# Altium schematic sheet lixie_schematic.SchDoc
size A4; SheetNumber: 1; SheetTotal: 1
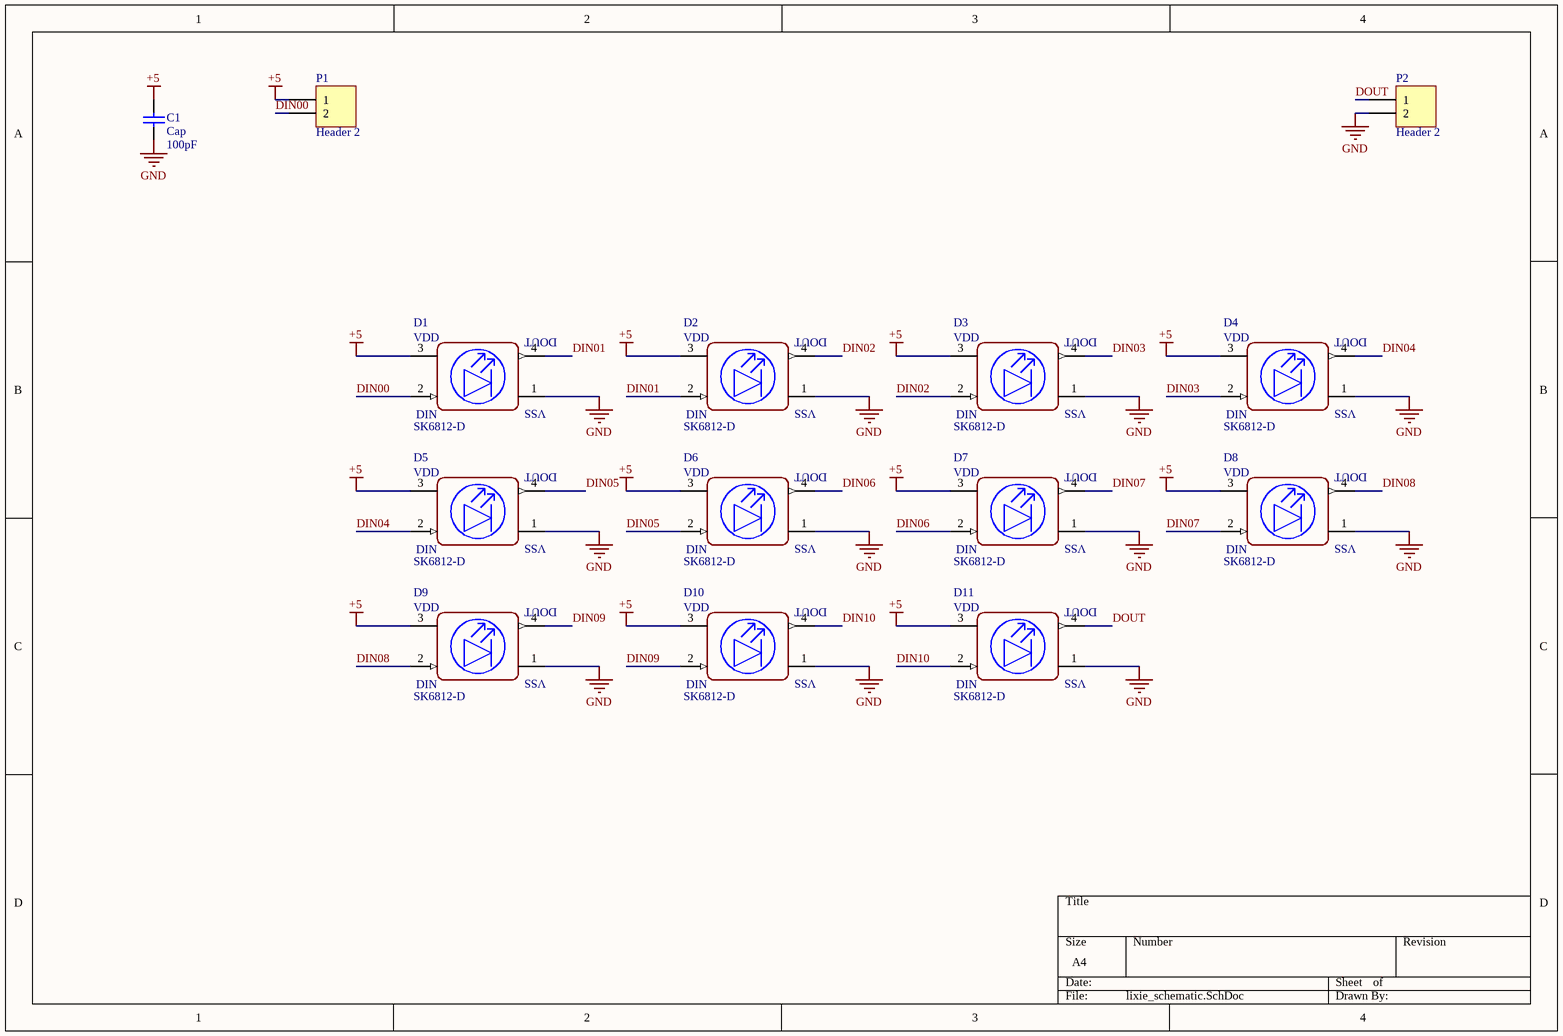
[diagram p0: lixie_schematic.SchDoc]

## Parts
C1  Cap  value 100pF  [RAD-0.3]
D1  Part Number: SK6812-D  [Adafruit_SK6812-D_0]  (hidden comment: Diode_Adafruit_SK6812-D_eec)
D2  Part Number: SK6812-D  [Adafruit_SK6812-D_0]  (hidden comment: Diode_Adafruit_SK6812-D_eec)
D3  Part Number: SK6812-D  [Adafruit_SK6812-D_0]
D4  Part Number: SK6812-D  [Adafruit_SK6812-D_0]  (hidden comment: Diode_Adafruit_SK6812-D_eec)
D5  Part Number: SK6812-D  [Adafruit_SK6812-D_0]  (hidden comment: Diode_Adafruit_SK6812-D_eec)
D6  Part Number: SK6812-D  [Adafruit_SK6812-D_0]  (hidden comment: Diode_Adafruit_SK6812-D_eec)
D7  Part Number: SK6812-D  [Adafruit_SK6812-D_0]  (hidden comment: Diode_Adafruit_SK6812-D_eec)
D8  Part Number: SK6812-D  [Adafruit_SK6812-D_0]  (hidden comment: Diode_Adafruit_SK6812-D_eec)
D9  Part Number: SK6812-D  [Adafruit_SK6812-D_0]  (hidden comment: Diode_Adafruit_SK6812-D_eec)
D10  Part Number: SK6812-D  [Adafruit_SK6812-D_0]  (hidden comment: Diode_Adafruit_SK6812-D_eec)
D11  Part Number: SK6812-D  [Adafruit_SK6812-D_0]  (hidden comment: Diode_Adafruit_SK6812-D_eec)
P1  Header 2  [HDR1X2]
P2  Header 2  [HDR1X2]

## Nets
+5: C1.2 D1.3(VDD) D2.3(VDD) D3.3(VDD) D4.3(VDD) D5.3(VDD) D6.3(VDD) D7.3(VDD) D8.3(VDD) D9.3(VDD) D10.3(VDD) D11.3(VDD) P1.1
GND: C1.1 D1.1(VSS) D2.1(VSS) D3.1(VSS) D4.1(VSS) D5.1(VSS) D6.1(VSS) D7.1(VSS) D8.1(VSS) D9.1(VSS) D10.1(VSS) D11.1(VSS) P2.2
DIN00: D1.2(DIN) P1.2
DIN01: D1.4(DOUT) D2.2(DIN)
DIN02: D2.4(DOUT) D3.2(DIN)
DIN03: D3.4(DOUT) D4.2(DIN)
DIN04: D4.4(DOUT) D5.2(DIN)
DIN05: D5.4(DOUT) D6.2(DIN)
DIN06: D6.4(DOUT) D7.2(DIN)
DIN07: D7.4(DOUT) D8.2(DIN)
DIN08: D8.4(DOUT) D9.2(DIN)
DIN09: D9.4(DOUT) D10.2(DIN)
DIN10: D10.4(DOUT) D11.2(DIN)
DOUT: D11.4(DOUT) P2.1

## Library data of the parts
C1 = Cap: Capacitor; Published: 8-Jun-2000; LatestRevisionDate: 17-Jul-2002; LatestRevisionNote: Re-released for DXP Platform.; PackageReference: RAD-0.3; Publisher: Altium Limited; PackageDescription: Radial Cap, Thru-Hole; 2 Leads; 0.3 in Pin Spacing
D3 = Diode_Adafruit_SK6812-D_eec: helpURL: https://upverter.com/upn/revision/c89e73b2d25df682/; ComponentLink2Description: Datasheet; Temperature: -40°C to +85°C; Package: SMT_LED_5MM0; Supplier 2: Mouser; Supplier 1: Digi-Key; ComponentLink1URL: https://upverter.com/upn/revision/c89e73b2d25df682/; Manufacturer: Adafruit; ComponentLink1Description: Upverter; ComponentLink2URL: https://cdn-shop.adafruit.com/product-files/1138/SK6812+LED+datasheet+.pdf; RoHS: TRUE; Temperature Range High: +85°C; Temperature Range Low: -40°C; Lead Free: yes; Ipc Land Pattern Name: SOIC320P540X160-4
P1 P2 = Header 2: Header, 2-Pin; LatestRevisionDate: 17-Jul-2002; LatestRevisionNote: Re-released for DXP Platform.; Publisher: Altium Limited
D1 D2 D4-D11 = Diode_Adafruit_SK6812-D_eec: helpURL: https://upverter.com/upn/revision/c89e73b2d25df682/; ComponentLink2Description: Datasheet; Temperature: -40°C to +85°C; Package: SMT_LED_5MM0; Supplier 2: Mouser; Supplier 1: Digi-Key; ComponentLink1URL: https://upverter.com/upn/revision/c89e73b2d25df682/; Manufacturer: Adafruit; ComponentLink1Description: Upverter; ComponentLink2URL: https://cdn-shop.adafruit.com/product-files/1138/SK6812+LED+datasheet+.pdf; RoHS: TRUE; Temperature Range High: +85°C; Temperature Range Low: -40°C; Lead Free: yes; Ipc Land Pattern Name: SOIC320P540X160-4